# Altium project arduinoLeonardoOwn.PrjPCB
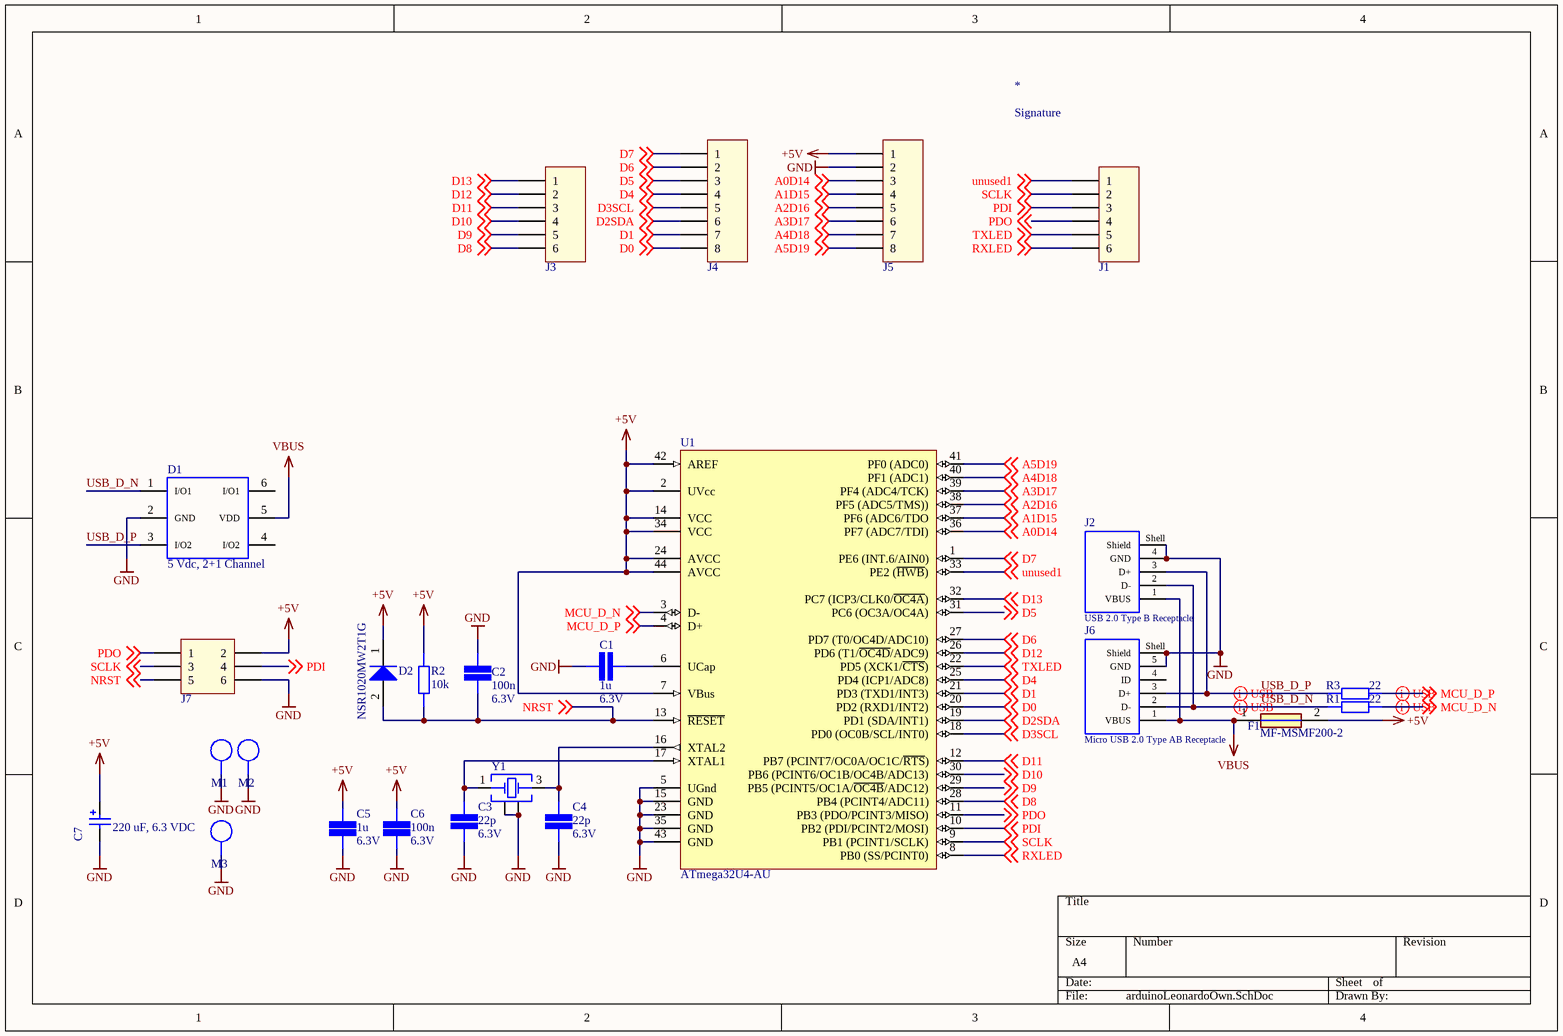
[diagram p0: arduinoLeonardoOwn.SchDoc]
1 sheet, 26 parts. Net scope: global (net labels, ports and power ports of the same name join across sheets).
Board file: arduinoLeonardoOwn.PcbDoc

## Sheet arduinoLeonardoOwn.SchDoc
size A4

### Parts
*  Signature  [Signature]
C1  value 1u  VoltageRating: 6.3V  [CAP 0805/2012]  (hidden comment: SMD Capacitor; 1u; 6.3V)
C2  value 100n  VoltageRating: 6.3V  [CAP 0603/1608]  (hidden comment: SMD Capacitor; 100n; 6.3V)
C3  value 22p  VoltageRating: 6.3V  [CAP 0603/1608]  (hidden comment: SMD Capacitor; 22p; 6.3V)
C4  value 22p  VoltageRating: 6.3V  [CAP 0603/1608]  (hidden comment: SMD Capacitor; 22p; 6.3V)
C5  value 1u  VoltageRating: 6.3V  [CAP 0805/2012]  (hidden comment: SMD Capacitor; 1u; 6.3V)
C6  value 100n  VoltageRating: 6.3V  [CAP 0603/1608]  (hidden comment: SMD Capacitor; 100n; 6.3V)
C7  220 uF, 6.3 VDC  [WCAP-PHGP_7.3x4.3x1.9]
D1  5 Vdc, 2+1 Channel  [WE-TVS_High Speed_SOT563]
D2  NSR1020MW2T1G  [ONSC-SOD-323-2-477-02_V]
F1  MF-MSMF200-2  [FUSC4632X85N]
J1  61300611121  [61300611121]  (value not drawn)
J2  USB 2.0 Type B Receptacle  [61400416121]
J3  61300611121  [61300611121]  (value not drawn)
J4  61300811121  [61300811121]  (value not drawn)
J5  61300811121  [61300811121]  (value not drawn)
J6  Micro USB 2.0 Type AB Receptacle  [629105150921]
J7  61300621121  [61300621121]  (value not drawn)
M1  mounting pad  [MOUNTING_PAD_M3]  (value not drawn)  (no BOM)
M2  mounting pad  [MOUNTING_PAD_M3]  (value not drawn)  (no BOM)
M3  mounting pad  [MOUNTING_PAD_M3]  (value not drawn)  (no BOM)
R1  value 22  [STACKPOLE CSR0603]  (hidden comment: SMD Resistor; 22)
R2  value 10k  [STACKPOLE CSR0603]  (hidden comment: SMD Resistor; 10k)
R3  value 22  [STACKPOLE CSR0603]  (hidden comment: SMD Resistor; 22)
U1  ATmega32U4-AU  [44ML_M]
Y1  16MHz, +/-50ppm, 18pF  [WE-XTAL_CFPX-104]  (value not drawn)

### Nets
+5V: C5.2 C6.2 C7.2(A) D2.1(K) F1.2 J5.1 J7.2 R2.1 U1.2(UVcc) U1.7(VBus) U1.14(VCC) U1.24(AVCC) U1.34(VCC) U1.42(AREF) U1.44(AVCC)
GND: C1.1 C2.1 C3.1 C4.1 C5.1 C6.1 C7.1(K) D1.2(GND) J2.4(GND) J2.Shell(Shield) J5.2 J6.5(GND) J6.Shell(Shield) J7.6 M1.1 M2.1 M3.1 U1.5(UGnd) U1.15(GND) U1.23(GND) U1.35(GND) U1.43(GND) Y1.2(GND) Y1.4(GND)
VBUS: D1.5(VDD) F1.1 J2.1(VBUS) J6.1(VBUS)
A0D14: J5.3 U1.36(PF7_(ADC7/TDI)) ; off-sheet A0D14
A1D15: J5.4 U1.37(PF6_(ADC6/TDO) ; off-sheet A1D15
A2D16: J5.5 U1.38(PF5_(ADC5/TMS))) ; off-sheet A2D16
A3D17: J5.6 U1.39(PF4_(ADC4/TCK)) ; off-sheet A3D17
A4D18: J5.7 U1.40(PF1_(ADC1)) ; off-sheet A4D18
A5D19: J5.8 U1.41(PF0_(ADC0)) ; off-sheet A5D19
D0: J4.8 U1.20(PD2_(RXD1/INT2)) ; off-sheet D0
D1: J4.7 U1.21(PD3_(TXD1/INT3)) ; off-sheet D1
D2SDA: J4.6 U1.19(PD1_(SDA/INT1)) ; off-sheet D2SDA
D3SCL: J4.5 U1.18(PD0_(OC0B/SCL/INT0)) ; off-sheet D3SCL
D4: J4.4 U1.25(PD4_(ICP1/ADC8)) ; off-sheet D4
D5: J4.3 U1.31(PC6_(OC3A/OC4A)) ; off-sheet D5
D6: J4.2 U1.27(PD7_(T0/OC4D/ADC10)) ; off-sheet D6
D7: J4.1 U1.1(PE6_(INT.6/AIN0)) ; off-sheet D7
D8: J3.6 U1.28(PB4_(PCINT4/ADC11)) ; off-sheet D8
D9: J3.5 U1.29(PB5_(PCINT5/OC1A/~{OC4B}/ADC12)) ; off-sheet D9
D10: J3.4 U1.30(PB6_(PCINT6/OC1B/OC4B/ADC13)) ; off-sheet D10
D11: J3.3 U1.12(PB7_(PCINT7/OC0A/OC1C/~{RTS})) ; off-sheet D11
D12: J3.2 U1.26(PD6_(T1/~{OC4D}/ADC9)) ; off-sheet D12
D13: J3.1 U1.32(PC7_(ICP3/CLK0/~{OC4A})) ; off-sheet D13
MCU_D_N: R1.2 U1.3(D-) ; off-sheet MCU_D_N
MCU_D_P: R3.2 U1.4(D+) ; off-sheet MCU_D_P
NRST: C2.2 D2.2(A) J7.5 R2.2 U1.13(~{RESET}) ; off-sheet NRST
PDI: J1.3 J7.4 U1.10(PB2_(PDI/PCINT2/MOSI)) ; off-sheet PDI
PDO: J1.4 J7.1 U1.11(PB3_(PDO/PCINT3/MISO)) ; off-sheet PDO
RXLED: J1.6 U1.8(PB0_(SS/PCINT0)) ; off-sheet RXLED
SCLK: J1.2 J7.3 U1.9(PB1_(PCINT1/SCLK)) ; off-sheet SCLK
TXLED: J1.5 U1.22(PD5_(XCK1/~{CTS})) ; off-sheet TXLED
unused1: J1.1 U1.33(PE2_(~{HWB})) ; off-sheet unused1
USB_D_N: D1.1(I/O1) J2.2(D-) J6.2(D-) R1.1
USB_D_P: D1.3(I/O2) J2.3(D+) J6.3(D+) R3.1
NetC1_2: C1.2 U1.6(UCap)
NetC3_2: C3.2 U1.17(XTAL1) Y1.1(OSC1)
NetC4_2: C4.2 U1.16(XTAL2) Y1.3(OSC2)

Not connected (* = marked no-connect by the designer): D1 4(I/O2) 6(I/O1); J6 4(ID)

### Layout directives
differential pair: MCU_D_N, MCU_D_P, USB_D_N, USB_D_P

### Library data of the parts
C1-C6 = SMD Capacitor: Capacitor with multiple Footprints
C7 = 875015119006: Aluminum Polymer Capacitors WCAP-PHGP, 220 uF, 6.3 VDC; Rated Voltage: 6.3 VDC; Capacitance: 220 uF; Leakage Current: 138.6 uA; Dissipation Factor: 6%; Endurance: 2000 h; ESR Resistance: 15 mOhm; Ripple Current: 5.1 A; ComponentLink1Description: Manufacturer; ComponentLink1URL: http://www.we-online.de; ComponentLink2Description: Datasheet; ComponentLink2URL: https://katalog.we-online.de/pbs/datasheet/875015119006.pdf; Part Number: 875015119006; Published Date: November 2018; Publisher: Wurth Elektronik; Size: 7.3x4.3x1.9; Operating Temperature: -55 to +105 degC; Mounting Technology: SMT; Packaging: Tape and Reel
D1 = 82400152: TVS Diode - High Speed Series WE-TVS, SOT563, 5 Vdc, 2+1 Channel; Reverse Breakdown Voltage min.: 6 V; Channel Input Capacitance: 2 pF; Reverse Peak Pulse Current: 6 A; Reverse Channel Leakage Current: 5 uA; DC Operating Voltage: 5 V; ComponentLink1Description: Manufacturer; ComponentLink1URL: http://www.we-online.de; ComponentLink2Description: Datasheet; ComponentLink2URL: https://katalog.we-online.de/pbs/datasheet/82400152.pdf; Part Number: 82400152; Published Date: November 2018; Publisher: Wurth Elektronik; Size: SOT563; Channel: 2+1; Operating Temperature: -40 to 125 degC; Mounting Technology: SMT; Packaging: Tape and Reel
D2 = CMP-1055-00471-1: Schottky Barrier Diode, 2-Pin SOD-323, Pb-Free, Tape and Reel; Manufacturer: On Semiconductor; IFSM Max (A): 5; Configuration: Single; ComponentLink2URL: http://www.onsemi.cn/pub_link/Collateral/NSR1020MW2T1-D.PDF; PackageDescription: 2-Pin SOD, Body 1.7 x 1.25 mm; ComponentLink3Description: Package Specification; RoHS: TRUE; PackageReference: SOD-323-2-477-02; PackageVersion: Rev. H, 03/2007; Mounting Technology: Surface Mount; DatasheetVersion: Rev. 1; ComponentLink1URL: http://www.onsemi.com/; PartNumber: NSR1020MW2T1G; Packing: Tape and Reel; ComponentLink1Description: Manufacturer URL; ComponentLink2Description: Datasheet; ComponentLink3URL: http://www.onsemi.com/pub_link/Collateral/477-02.PDF.1
F1 = MF-MSMF200-2: Fuse; Manufacturer_Name: Bourns; Datasheet Link: https://componentsearchengine.com//MF-MSMF200-2.pdf; Height: 0.85mm; Mouser2 Part Number: 652-MF-MSMF200-2; Mouser2 Price/Stock: https://www.mouser.com/Search/Refine.aspx?Keyword=652-MF-MSMF200-2; Manufacturer_Part_Number: MF-MSMF200-2
J1 J3 = 61300611121: WR-PHD 2.54 mm THT Pin Header, 6p; Pin Number: 6; Rated Current: 3 A; Working Voltage: 250 VAC; Withstanding Voltage: 500 VAC; Pitch: 2.54 mm; ComponentLink1Description: Manufacturer; ComponentLink1URL: http://www.we-online.de; ComponentLink2Description: Datasheet; ComponentLink2URL: http://katalog.we-online.de/em/datasheet/6130xx11121.pdf; Part Number: 61300611121; Published Date: Aug 2017; Publisher: Wurth Elektronik
J2 = 61400416121: USB 2.0 Type B, Receptacle, Horizontal, THT; Manufacturer: Wurth Elektronik; Rated Current: 1.5A; Pin Number: 4; Interface Type: Type B; Working Voltage: 30VAC; ComponentLink1Description: Manufacturer; ComponentLink1URL: http://www.we-online.de; ComponentLink2Description: Datasheet; ComponentLink2URL: https://katalog.we-online.com/em/datasheet/61400416121.pdf; Published Date: August 2020; Manufacturer Part Number: 61400416121; Gender: Receptacle; Type: Horizontal; Packaging: Tray; Operating Temperature: -40 to +105degC; Mounting Technology: THT; Application: USB 2.0
J4 J5 = 61300811121: WR-PHD 2.54 mm THT Pin Header, 8p; Pin Number: 8; Rated Current: 3 A; Working Voltage: 250 VAC; Withstanding Voltage: 500 VAC; Pitch: 2.54 mm; ComponentLink1Description: Manufacturer; ComponentLink1URL: http://www.we-online.de; ComponentLink2Description: Datasheet; ComponentLink2URL: http://katalog.we-online.de/em/datasheet/6130xx11121.pdf; Part Number: 61300811121; Published Date: Aug 2017; Publisher: Wurth Elektronik
J6 = 629105150921: Micro USB 2.0 Type AB, Receptacle, Horizontal, SMT; Manufacturer: Wurth Elektronik; Rated Current: 1.8A; Pin Number: 5; Interface Type: Type AB; Working Voltage: 30VAC; ComponentLink1Description: Manufacturer; ComponentLink1URL: http://www.we-online.de; ComponentLink2Description: Datasheet; ComponentLink2URL: https://katalog.we-online.com/em/datasheet/629105150921.pdf; Published Date: August 2020; Manufacturer Part Number: 629105150921; Gender: Receptacle; Type: Horizontal; Packaging: Tape and Reel; Operating Temperature: -40 to +85degC; Mounting Technology: SMT; Application: Micro USB 2.0
J7 = 61300621121: WR-PHD 2.54 mm THT Dual Pin Header, 6p; Pin Number: 6; Rated Current: 3 A; Working Voltage: 250 VAC; Withstanding Voltage: 500 VAC; Pitch: 2.54 mm; ComponentLink1Description: Manufacturer; ComponentLink1URL: http://www.we-online.de; ComponentLink2Description: Datasheet; ComponentLink2URL: http://katalog.we-online.de/em/datasheet/6130xx21121.pdf; Part Number: 61300621121; Published Date: Aug 2017; Publisher: Wurth Elektronik
R1-R3 = SMD Resistor: Resistor with multiple footprints
U1 = CMP-0095-00285-2: 8-bit AVR Microcontroller, 2.7-5.5V, 16MHz, 32KB Flash, 1KB EEPROM, 2.5KB SRAM, USB Controller, 44-pin TQFP, Industrial Grade (-40°C to 85°C), Ext Osc; RevisionNote: DatasheetVersion updated. URLs added.; ComponentLink1Description: Manufacturer URL; PackageDescription: 44-Pin Plastic Thin Quad Flat Pack, 10 x 10 x 1.0 mm Body, 0.8 mm Pitch (TQFP); DatasheetVersion: revF, Nov-2010; ComponentLink2URL: http://www.atmel.com/dyn/resources/prod_documents/doc7766.pdf; ComponentLink1URL: http://www.atmel.com/; PackageReference: 44ML; ComponentLink2Description: ATmega16U4/32U4 Datasheet; PackageVersion: rev.G, Jul-2007; ComponentLink3URL: http://www.atmel.com/dyn/resources/prod_documents/7766S.pdf; ComponentLink3Description: ATmega16U4 ATmega32U4 Summary
Y1 = 830030819: WE-XTAL Quartz Crystal, size CFPX-104, 16MHz, +/-50ppm, 18pF; Frequency Stability: 50ppm; ComponentLink1Description: Manufacturer; ComponentLink1URL: http://www.we-online.de; ComponentLink2Description: Datasheet; ComponentLink2URL: https://katalog.we-online.com/pbs/datasheet/830030819.pdf; Part Number: 830030819; Published Date: March 2019; Publisher: Wurth Elektronik; Size: CFPX-104; Operating Temperature: -10 up to +60degC; Mounting Technology: SMT; Packaging: Tape and Reel; Load Capacitance: 18pF; Frequency Tolerance: +/-50ppm; Frequency: 16MHz